# Altium schematic sheet RK3562-VCCIO6.SchDoc
size 420 x 297 mm; SheetNumber: 11; SheetTotal: 32
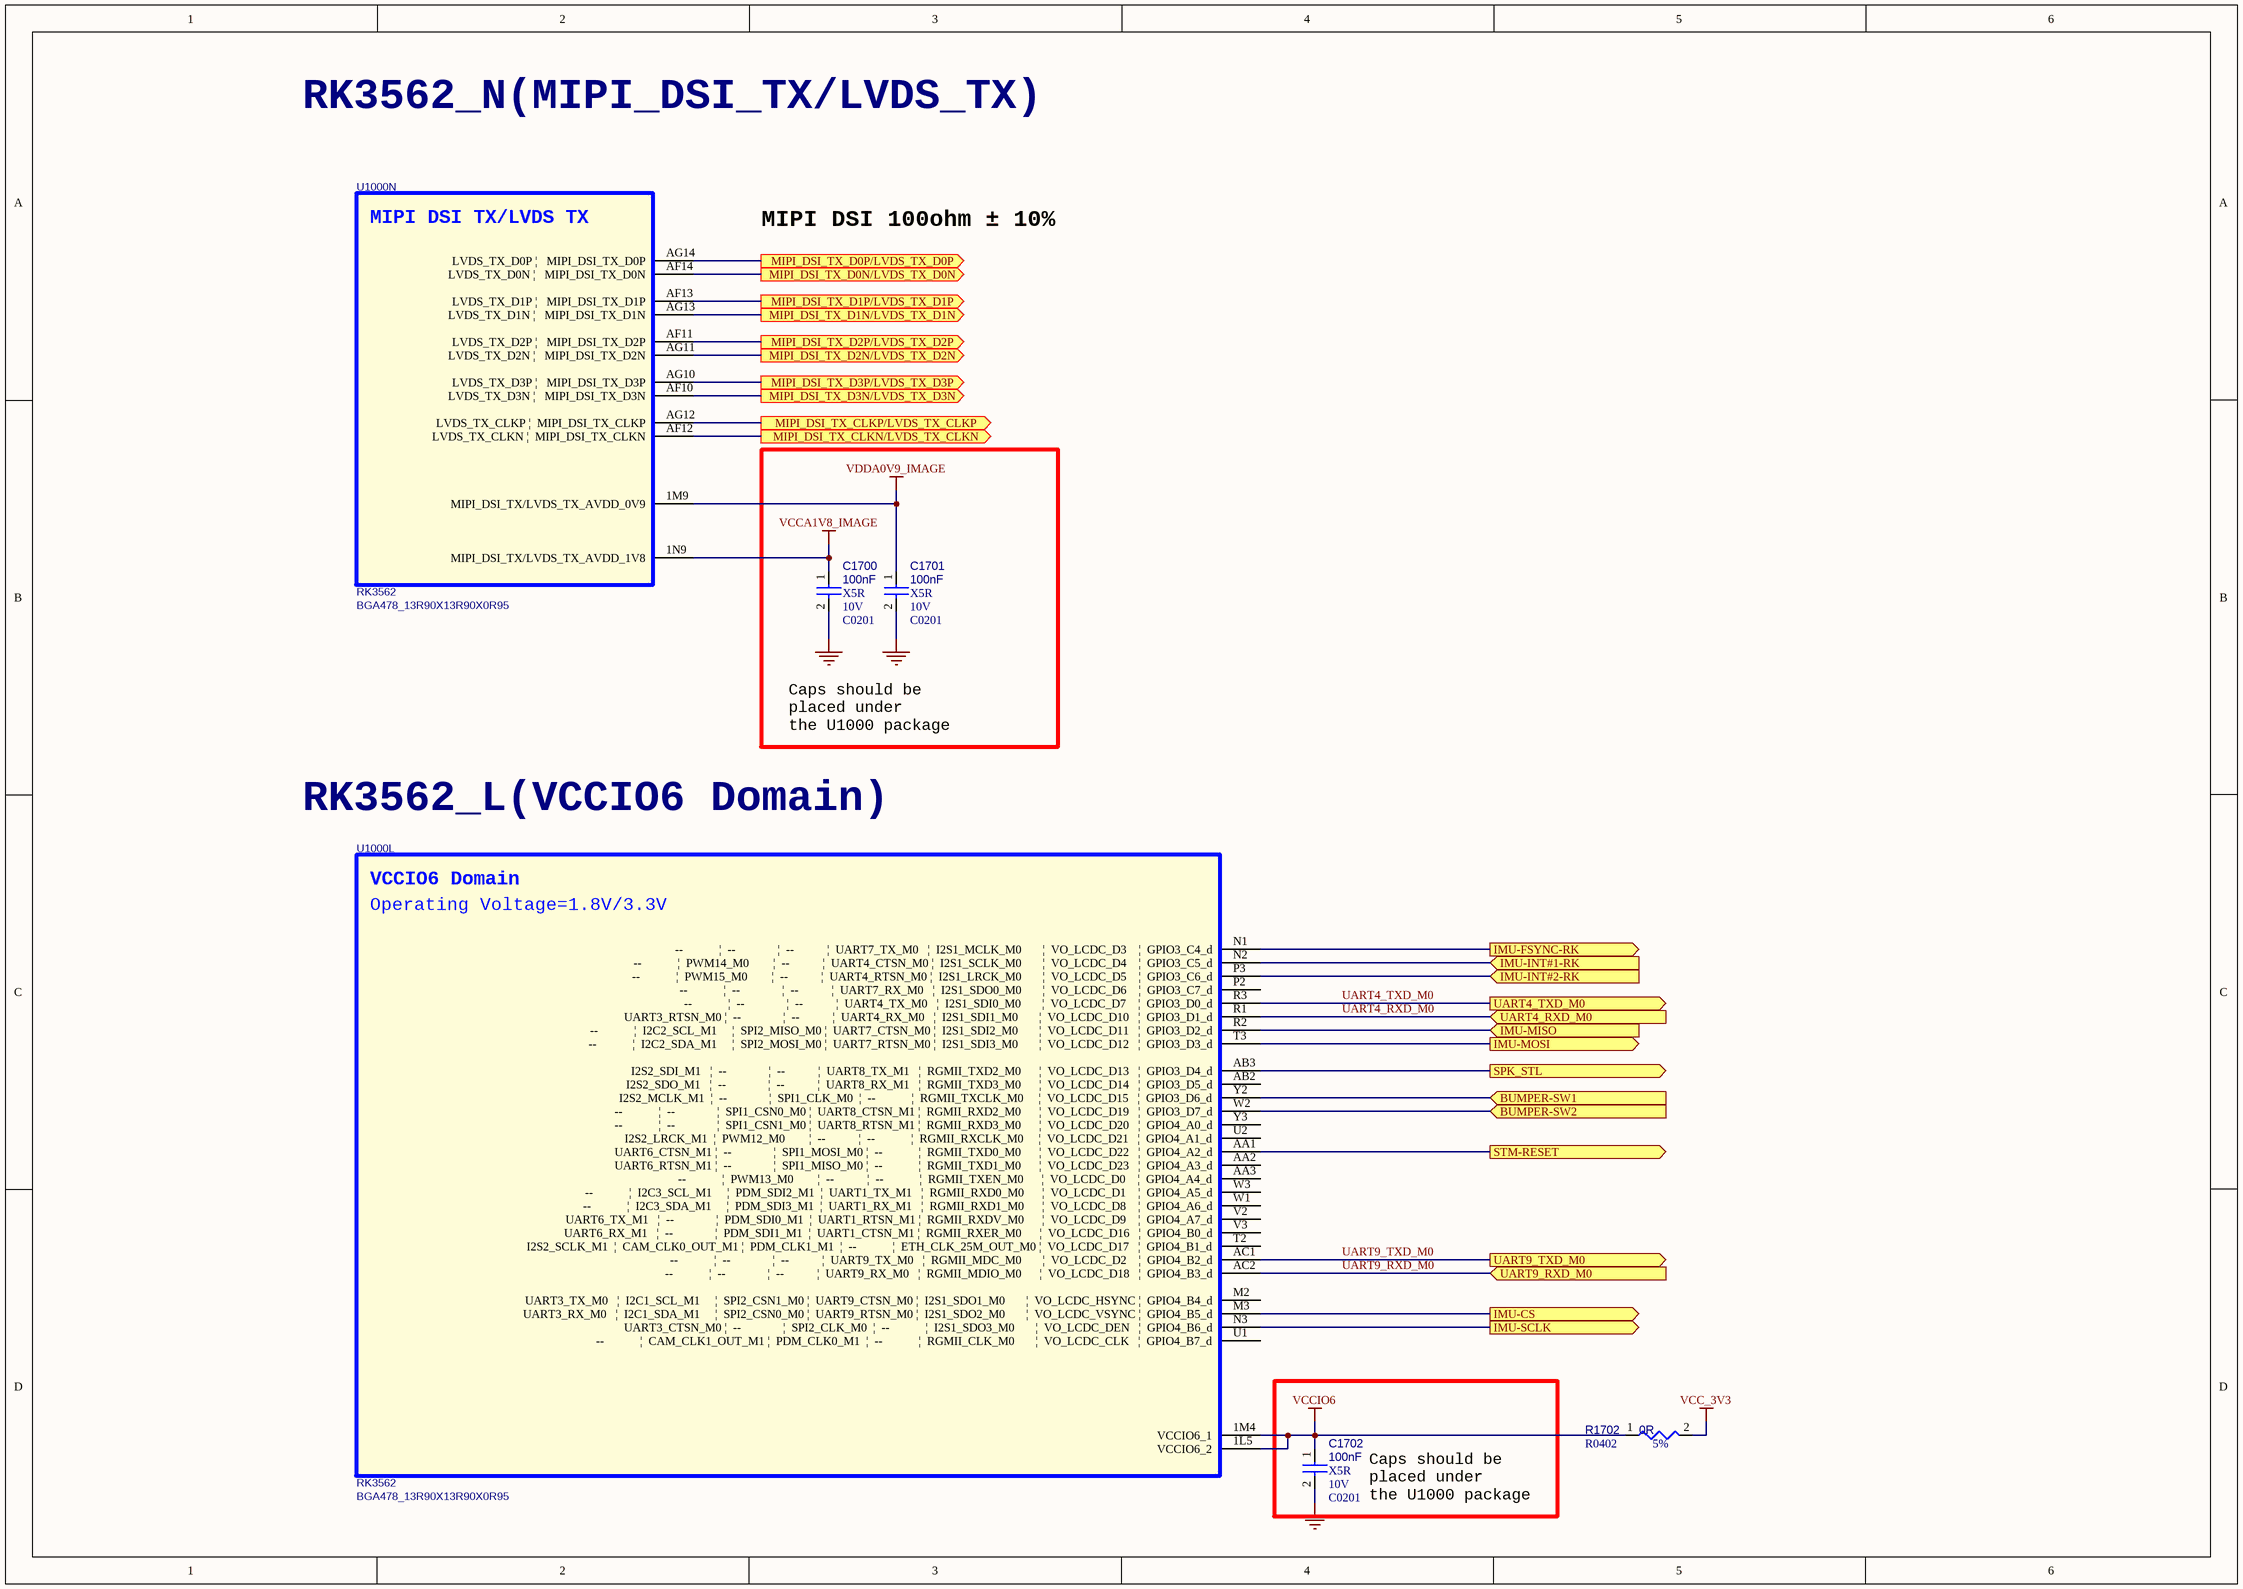
[diagram p0: RK3562-VCCIO6.SchDoc]

## Parts
C1700  100nF  Dielectric: X5R  Voltage: 10V  [C0201]
C1701  100nF  Dielectric: X5R  Voltage: 10V  [C0201]
C1702  100nF  Dielectric: X5R  Voltage: 10V  [C0201]
R1702  0R  Tolerance: 5%  [R0402]
U1000  RK3562  [BGA478_13R90X13R90X0R95]  (parts L,N of 16)

## Ports
BUMPER-SW1 (in, see CONTROLLER-RK3562[4D], CONTROLLER-RK3562[3D]), BUMPER-SW2 (in, see CONTROLLER-RK3562[4D], CONTROLLER-RK3562[3D]), IMU-CS (out, see CONTROLLER-RK3562[4D], CONTROLLER-RK3562[3D]), IMU-FSYNC-RK (out, see CONTROLLER-RK3562[4D], CONTROLLER-RK3562[3D]), IMU-INT#1-RK (in, see CONTROLLER-RK3562[4D], CONTROLLER-RK3562[3D]), IMU-INT#2-RK (in, see CONTROLLER-RK3562[4D], CONTROLLER-RK3562[3D]), IMU-MISO (in, see CONTROLLER-RK3562[4D], CONTROLLER-RK3562[3D]), IMU-MOSI (out, see CONTROLLER-RK3562[4D], CONTROLLER-RK3562[3D]), IMU-SCLK (out, see CONTROLLER-RK3562[4D], CONTROLLER-RK3562[3D]), MIPI_DSI_TX_CLKN/LVDS_TX_CLKN (out, see CONTROLLER-RK3562[4C]), MIPI_DSI_TX_CLKP/LVDS_TX_CLKP (out, see CONTROLLER-RK3562[4C]), MIPI_DSI_TX_D0N/LVDS_TX_D0N (out, see CONTROLLER-RK3562[4C]), MIPI_DSI_TX_D0P/LVDS_TX_D0P (out, see CONTROLLER-RK3562[4C]), MIPI_DSI_TX_D1N/LVDS_TX_D1N (out, see CONTROLLER-RK3562[4C]), MIPI_DSI_TX_D1P/LVDS_TX_D1P (out, see CONTROLLER-RK3562[4C]), MIPI_DSI_TX_D2N/LVDS_TX_D2N (out, see CONTROLLER-RK3562[4C]), MIPI_DSI_TX_D2P/LVDS_TX_D2P (out, see CONTROLLER-RK3562[4C]), MIPI_DSI_TX_D3N/LVDS_TX_D3N (out, see CONTROLLER-RK3562[4C]), MIPI_DSI_TX_D3P/LVDS_TX_D3P (out, see CONTROLLER-RK3562[4C]), SPK_STL (out, see CONTROLLER-RK3562[4C]), STM-RESET (out, see CONTROLLER-RK3562[4D], CONTROLLER-RK3562[3D], STM32G070RBT6[1A]), UART4_RXD_M0 (in, see CONTROLLER-RK3562[4C]), UART4_TXD_M0 (out, see CONTROLLER-RK3562[4C]), UART9_RXD_M0 (in, see CONTROLLER-RK3562[4D]), UART9_TXD_M0 (out, see CONTROLLER-RK3562[4D])

## Nets
GND: C1700.2 C1701.2 C1702.2
VCC_3V3: R1702.2
VCCA1V8_IMAGE: C1700.1 U1000.1N9(MIPI_DSI_TX/LVDS_TX_AVDD_1V8)
VCCIO6: C1702.1 R1702.1 U1000.1L5(VCCIO6_2) U1000.1M4(VCCIO6_1)
VDDA0V9_IMAGE: C1701.1 U1000.1M9(MIPI_DSI_TX/LVDS_TX_AVDD_0V9)
BUMPER-SW1: U1000.Y2(I2S2_MCLK_M1__|__--______________|__SPI1_CLK_M0__|__--____________|__RGMII_TXCLK_M0_____|__VO_LCDC_D15___|__GPIO3_D6_d) ; port BUMPER-SW1
BUMPER-SW2: U1000.W2(--____________|__--______________|__SPI1_CSN0_M0_|__UART8_CTSN_M1_|__RGMII_RXD2_M0______|__VO_LCDC_D19___|__GPIO3_D7_d) ; port BUMPER-SW2
IMU-CS: U1000.M3(UART3_RX_M0___|__I2C1_SDA_M1_____|__SPI2_CSN0_M0_|__UART9_RTSN_M0_|__I2S1_SDO2_M0_______|__VO_LCDC_VSYNC_|__GPIO4_B5_d) ; port IMU-CS
IMU-FSYNC-RK: U1000.N1(--____________|__--______________|__--___________|__UART7_TX_M0___|__I2S1_MCLK_M0_______|__VO_LCDC_D3____|__GPIO3_C4_d) ; port IMU-FSYNC-RK
IMU-INT#1-RK: U1000.N2(--____________|__PWM14_M0________|__--___________|__UART4_CTSN_M0_|__I2S1_SCLK_M0_______|__VO_LCDC_D4____|__GPIO3_C5_d) ; port IMU-INT#1-RK
IMU-INT#2-RK: U1000.P3(--____________|__PWM15_M0________|__--___________|__UART4_RTSN_M0_|__I2S1_LRCK_M0_______|__VO_LCDC_D5____|__GPIO3_C6_d) ; port IMU-INT#2-RK
IMU-MISO: U1000.R2(--____________|__I2C2_SCL_M1_____|__SPI2_MISO_M0_|__UART7_CTSN_M0_|__I2S1_SDI2_M0_______|__VO_LCDC_D11___|__GPIO3_D2_d) ; port IMU-MISO
IMU-MOSI: U1000.T3(--____________|__I2C2_SDA_M1_____|__SPI2_MOSI_M0_|__UART7_RTSN_M0_|__I2S1_SDI3_M0_______|__VO_LCDC_D12___|__GPIO3_D3_d) ; port IMU-MOSI
IMU-SCLK: U1000.N3(UART3_CTSN_M0_|__--______________|__SPI2_CLK_M0__|__--____________|__I2S1_SDO3_M0_______|__VO_LCDC_DEN___|__GPIO4_B6_d) ; port IMU-SCLK
MIPI_DSI_TX_CLKN/LVDS_TX_CLKN: U1000.AF12(LVDS_TX_CLKN_|__MIPI_DSI_TX_CLKN) ; port MIPI_DSI_TX_CLKN/LVDS_TX_CLKN
MIPI_DSI_TX_CLKP/LVDS_TX_CLKP: U1000.AG12(LVDS_TX_CLKP_|__MIPI_DSI_TX_CLKP) ; port MIPI_DSI_TX_CLKP/LVDS_TX_CLKP
MIPI_DSI_TX_D0N/LVDS_TX_D0N: U1000.AF14(LVDS_TX_D0N_|___MIPI_DSI_TX_D0N) ; port MIPI_DSI_TX_D0N/LVDS_TX_D0N
MIPI_DSI_TX_D0P/LVDS_TX_D0P: U1000.AG14(LVDS_TX_D0P_|___MIPI_DSI_TX_D0P) ; port MIPI_DSI_TX_D0P/LVDS_TX_D0P
MIPI_DSI_TX_D1N/LVDS_TX_D1N: U1000.AG13(LVDS_TX_D1N_|___MIPI_DSI_TX_D1N) ; port MIPI_DSI_TX_D1N/LVDS_TX_D1N
MIPI_DSI_TX_D1P/LVDS_TX_D1P: U1000.AF13(LVDS_TX_D1P_|___MIPI_DSI_TX_D1P) ; port MIPI_DSI_TX_D1P/LVDS_TX_D1P
MIPI_DSI_TX_D2N/LVDS_TX_D2N: U1000.AG11(LVDS_TX_D2N_|___MIPI_DSI_TX_D2N) ; port MIPI_DSI_TX_D2N/LVDS_TX_D2N
MIPI_DSI_TX_D2P/LVDS_TX_D2P: U1000.AF11(LVDS_TX_D2P_|___MIPI_DSI_TX_D2P) ; port MIPI_DSI_TX_D2P/LVDS_TX_D2P
MIPI_DSI_TX_D3N/LVDS_TX_D3N: U1000.AF10(LVDS_TX_D3N_|___MIPI_DSI_TX_D3N) ; port MIPI_DSI_TX_D3N/LVDS_TX_D3N
MIPI_DSI_TX_D3P/LVDS_TX_D3P: U1000.AG10(LVDS_TX_D3P_|___MIPI_DSI_TX_D3P) ; port MIPI_DSI_TX_D3P/LVDS_TX_D3P
SPK_STL: U1000.AB3(I2S2_SDI_M1___|__--______________|__--___________|__UART8_TX_M1___|__RGMII_TXD2_M0______|__VO_LCDC_D13___|__GPIO3_D4_d) ; port SPK_STL
STM-RESET: U1000.AA1(UART6_CTSN_M1_|__--______________|__SPI1_MOSI_M0_|__--____________|__RGMII_TXD0_M0______|__VO_LCDC_D22___|__GPIO4_A2_d) ; port STM-RESET
UART4_RXD_M0: U1000.R1(UART3_RTSN_M0_|__--______________|__--___________|__UART4_RX_M0___|__I2S1_SDI1_M0_______|__VO_LCDC_D10___|__GPIO3_D1_d) ; port UART4_RXD_M0
UART4_TXD_M0: U1000.R3(--____________|__--______________|__--___________|__UART4_TX_M0___|__I2S1_SDI0_M0_______|__VO_LCDC_D7____|__GPIO3_D0_d) ; port UART4_TXD_M0
UART9_RXD_M0: U1000.AC2(--____________|__--______________|__--___________|__UART9_RX_M0___|__RGMII_MDIO_M0______|__VO_LCDC_D18___|__GPIO4_B3_d) ; port UART9_RXD_M0
UART9_TXD_M0: U1000.AC1(--____________|__--______________|__--___________|__UART9_TX_M0___|__RGMII_MDC_M0_______|__VO_LCDC_D2____|__GPIO4_B2_d) ; port UART9_TXD_M0

Not connected (* = marked no-connect by the designer): U1000 AA2(UART6_RTSN_M1_|__--______________|__SPI1_MISO_M0_|__--____________|__RGMII_TXD1_M0______|__VO_LCDC_D23___|__GPIO4_A3_d) AA3(--____________|__PWM13_M0________|__--___________|__--____________|__RGMII_TXEN_M0______|__VO_LCDC_D0____|__GPIO4_A4_d) AB2(I2S2_SDO_M1___|__--______________|__--___________|__UART8_RX_M1___|__RGMII_TXD3_M0______|__VO_LCDC_D14___|__GPIO3_D5_d) M2(UART3_TX_M0___|__I2C1_SCL_M1_____|__SPI2_CSN1_M0_|__UART9_CTSN_M0_|__I2S1_SDO1_M0_______|__VO_LCDC_HSYNC_|__GPIO4_B4_d) P2(--____________|__--______________|__--___________|__UART7_RX_M0___|__I2S1_SDO0_M0_______|__VO_LCDC_D6____|__GPIO3_C7_d) T2(I2S2_SCLK_M1__|__CAM_CLK0_OUT_M1_|__PDM_CLK1_M1__|__--____________|__ETH_CLK_25M_OUT_M0_|__VO_LCDC_D17___|__GPIO4_B1_d) U1(--____________|__CAM_CLK1_OUT_M1_|__PDM_CLK0_M1__|__--____________|__RGMII_CLK_M0_______|__VO_LCDC_CLK___|__GPIO4_B7_d) U2(I2S2_LRCK_M1__|__PWM12_M0________|__--___________|__--____________|__RGMII_RXCLK_M0_____|__VO_LCDC_D21___|__GPIO4_A1_d) V2(UART6_TX_M1___|__--______________|__PDM_SDI0_M1__|__UART1_RTSN_M1_|__RGMII_RXDV_M0______|__VO_LCDC_D9____|__GPIO4_A7_d) V3(UART6_RX_M1___|__--______________|__PDM_SDI1_M1__|__UART1_CTSN_M1_|__RGMII_RXER_M0______|__VO_LCDC_D16___|__GPIO4_B0_d) W1(--____________|__I2C3_SDA_M1_____|__PDM_SDI3_M1__|__UART1_RX_M1___|__RGMII_RXD1_M0______|__VO_LCDC_D8____|__GPIO4_A6_d) W3(--____________|__I2C3_SCL_M1_____|__PDM_SDI2_M1__|__UART1_TX_M1___|__RGMII_RXD0_M0______|__VO_LCDC_D1____|__GPIO4_A5_d) Y3(--____________|__--______________|__SPI1_CSN1_M0_|__UART8_RTSN_M1_|__RGMII_RXD3_M0______|__VO_LCDC_D20___|__GPIO4_A0_d)

## Notes on the sheet
- RK3562_N(MIPI_DSI_TX/LVDS_TX)
- MIPI DSI 100ohm ± 10%
- Caps should be
  placed under
  the U1000 package
- RK3562_L(VCCIO6 Domain)
- (in symbol SOC_RK3562, part L) VCCIO6 Domain; Operating Voltage=1.8V/3.3V
- (in symbol SOC_RK3562, part N) MIPI DSI TX/LVDS TX

## Library data of the parts
C1700 = CAP NP: cap,100.00nF,+/-10%,10V,X5R,C0201; Part Reference: C1700; Manufacturer PN: C0603X5R1A104K030BC; Manufacturer: TDK; Tolerance: 10%; Priority: A; PCB Footprint: C0201; Value: 100nF; Created by: JJJ; Part Type: C0201; RK PN: C0603X5R1A104K030BC; ClassName: RK
C1701 = CAP NP: cap,100.00nF,+/-10%,10V,X5R,C0201; Part Reference: C1701; Manufacturer: TDK; RK PN: C0603X5R1A104K030BC; Priority: A; Tolerance: 10%; PCB Footprint: C0201; Value: 100nF; Part Type: C0201; Manufacturer PN: C0603X5R1A104K030BC; Created by: JJJ; ClassName: RK
C1702 = CAP NP: cap,100.00nF,+/-10%,10V,X5R,C0201; Part Reference: C1702; Manufacturer PN: C0603X5R1A104K030BC; Manufacturer: TDK; Tolerance: 10%; Priority: A; PCB Footprint: C0201; Value: 100nF; Created by: JJJ; Part Type: C0201; RK PN: C0603X5R1A104K030BC; ClassName: RK
R1702 = RESISTOR: 通用厚膜电阻,0R,+/-5%,R0402,1/16W.; Part Reference: R1702; Manufacturer: YAGEO; Manufacturer PN: RC0402JR-070RL; RK PN: 901001446; Priority: A; Wattage: 1/16W; PCB Footprint: R0402; Value: 0R; Part Type: 通用厚膜电阻; Created by: YTL; ClassName: RK
U1000 = SOC_RK3562: ROCKCHIP SOC; Part Reference: U1000; Manufacturer: Rockchip (瑞芯微); SPLIT_INST: TRUE; SWAP_INFO: (S1+S2+S3+S4+S5+S6+S7+S8+S9+S10+S11+S12+S13+S14+S15+S16); Priority: A; RK PN: 906000425; PCB Footprint: BGA478_13R90X13R90X0R95; Value: RK3562; Created by: JJJ; Manufacturer PN: RK3562; Part Type: SOC; ClassName: RK